# EAGLE design sidpi (EAGLE 6.5.0)
.,m,.m,.m,.m,.m.,m
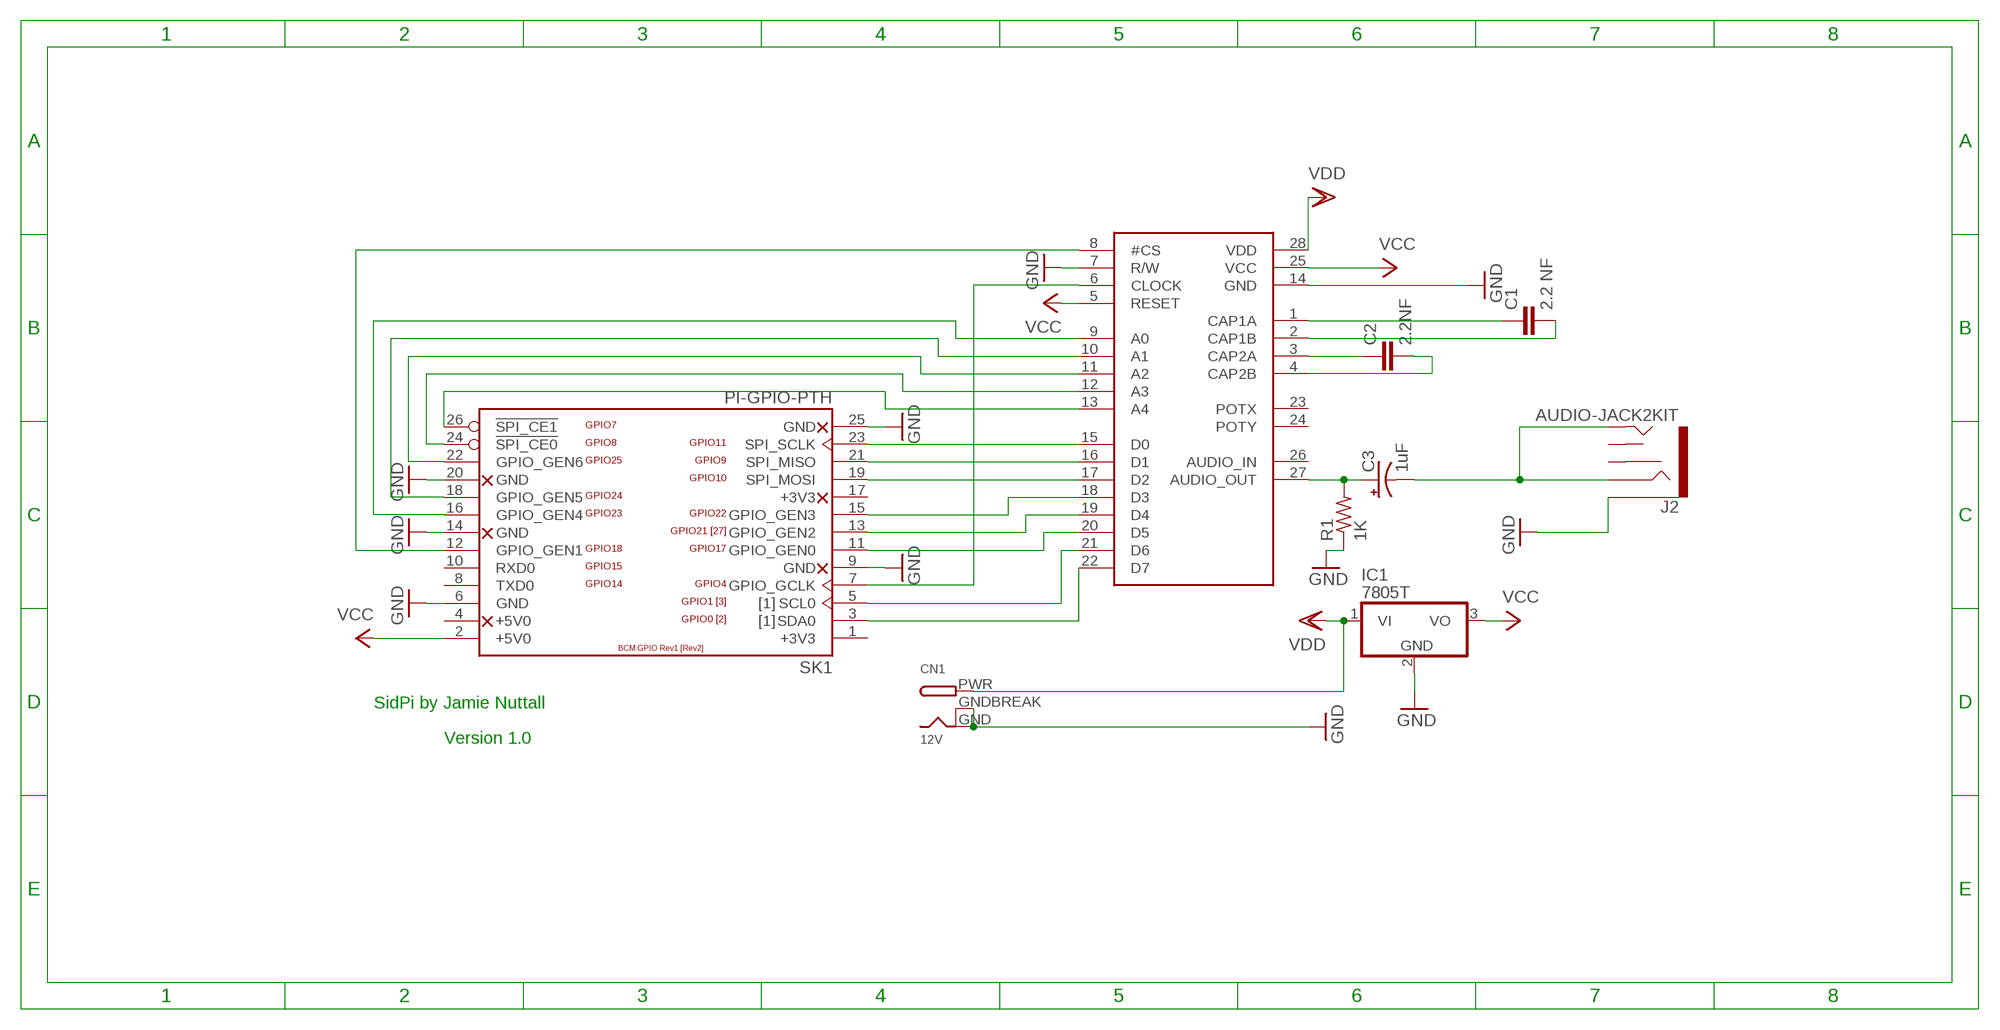
[diagram p0: schematic, sheet 1]

## Parts
C1  2.2 NF  CAPPTH2  [CAP-PTH-SMALL2]
C2  2.2NF  CAPPTH2  [CAP-PTH-SMALL2]
C3  1uF  CPOL-USE1.8-4  [E1,8-4]
CN1  12V  DCBARRELPTH  [DCJACK_2MM_PTH]
IC1  7805T  [TO220H]
J2  AUDIO-JACK2KIT  [AUDIO-JACK-KIT]
R1  1K  R-US_0309/10  [0309/10]
SK1  PI-GPIO-PTH  [GPIO-CONNECTOR]
U$1  6581  [DIL28-6]

## Nets
GND: CN1.GND CN1.GNDBREAK IC1.2(GND) J2.SLEEVE R1.1 SK1.6(GND) SK1.9(GND) SK1.14(GND) SK1.20(GND) SK1.25(GND) U$1.7(R/W) U$1.14(GND)
N$1: SK1.12(GPIO_GEN1) U$1.8(#CS)
N$2: SK1.24(!SPI_CE0) U$1.12(A3)
N$3: C1.1 U$1.1(CAP1A)
N$4: SK1.26(!SPI_CE1) U$1.13(A4)
N$5: SK1.3(SDA0) U$1.22(D7)
N$6: C2.1 U$1.3(CAP2A)
N$7: SK1.5(SCL0) U$1.21(D6)
N$8: C3.- J2.RING J2.TIP
N$9: SK1.7(GPIO_GCLK) U$1.6(CLOCK)
N$10: SK1.11(GPIO_GEN0) U$1.20(D5)
N$11: SK1.13(GPIO_GEN2) U$1.19(D4)
N$12: SK1.15(GPIO_GEN3) U$1.18(D3)
N$13: SK1.19(SPI_MOSI) U$1.17(D2)
N$14: SK1.21(SPI_MISO) U$1.16(D1)
N$15: C2.2 U$1.4(CAP2B)
N$17: C1.2 U$1.2(CAP1B)
N$19: SK1.23(SPI_SCLK) U$1.15(D0)
N$20: SK1.22(GPIO_GEN6) U$1.11(A2)
N$23: C3.+ R1.2 U$1.27(AUDIO_OUT)
N$24: SK1.16(GPIO_GEN4) U$1.9(A0)
N$25: SK1.18(GPIO_GEN5) U$1.10(A1)
VCC [VCC]: IC1.3(VO) SK1.2(+5V0) U$1.5(RESET) U$1.25(VCC)
VDD [VDD]: CN1.PWR IC1.1(VI) U$1.28(VDD)
Unconnected: J2.RSH J2.TSH SK1.4(+5V0) SK1.8(TXD0) SK1.10(RXD0) SK1.17(+3V3) U$1.23(POTX) U$1.24(POTY) U$1.26(AUDIO_IN)

## Notes on the sheet
- SidPi by Jamie Nuttall
- Version 1.0

## Power pins joined to a net without a drawn wire
+3V3: SK1.1(+3V3)

## Library data of the parts
C1 C2 = SparkFun-Capacitors:CAP: Capacitor Standard 0603 ceramic capacitor, and 0.1" leaded capacitor.
C3 = adafruit:CPOL-US: POLARIZED CAPACITOR, American symbol
CN1 = adafruit:DCBARREL: 2.0mm DC Barrel Jack DCJACK_2MM_PTH - Through Hole Jack (4UConnector: 05537)
IC1 = linear:78*: Positive VOLTAGE REGULATOR Source: http://cache.national.com/ds/LM/LM78L05.pdf http://www.fairchildsemi.com/ds/LM/LM7805.pdf; MF: ROHM; MPN: BA17805T; OC_FARNELL: 1831821
J2 = SparkFun-Connectors:AUDIO-JACK2: Stereo audio jack with bypass switches. SMT version used on LilyPad MP3 board.; PROD_ID: CONN-08774
R1 = adafruit:R-US_: RESISTOR, American symbol
SK1 = jt-raspberry-pi:PI-: Raspberry Pi; OC_FARNELL: unknown
U$1 = Mos6581_sid:6581: The Famous C64 Sound Chip - MOS6581; OC_FARNELL: unknown

## Net classes
0 default: width 0.5 mm, drill 0.4 mm, clearance 0.5 mm
1 VDD: width 1 mm, drill 0.4 mm, clearance 0.5 mm
2 VCC: width 1 mm, drill 0.4 mm, clearance 0.5 mm

## Board
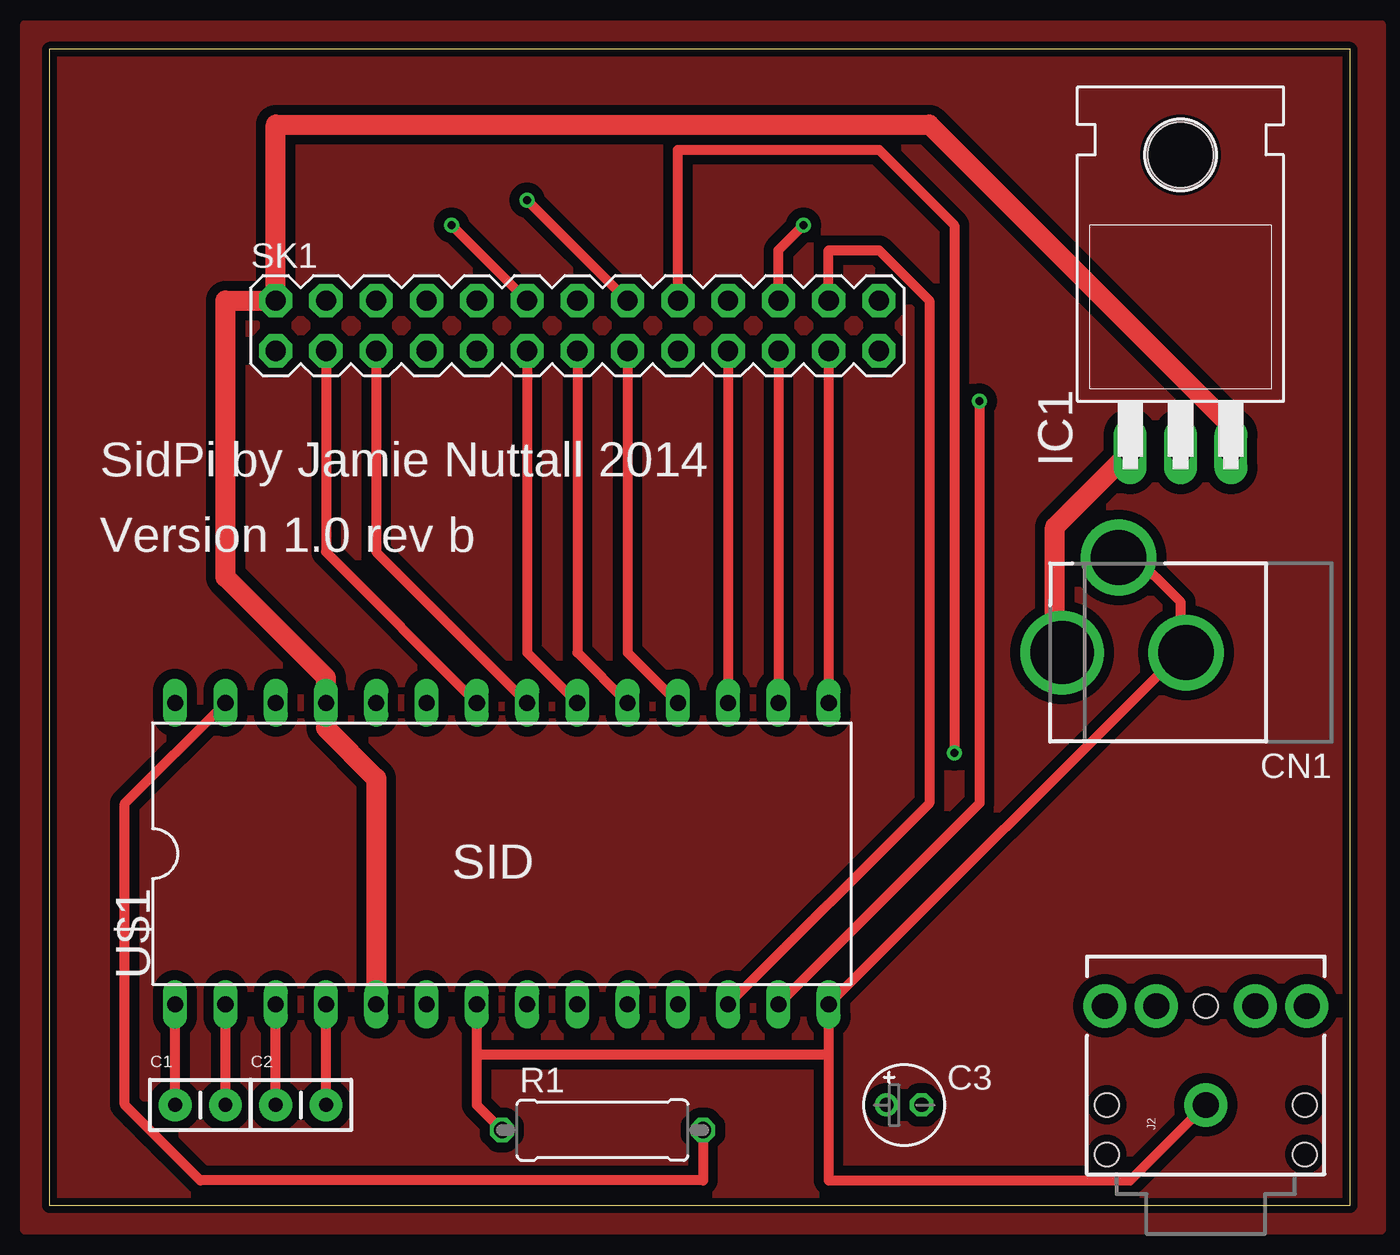
[diagram p1: board, top side]
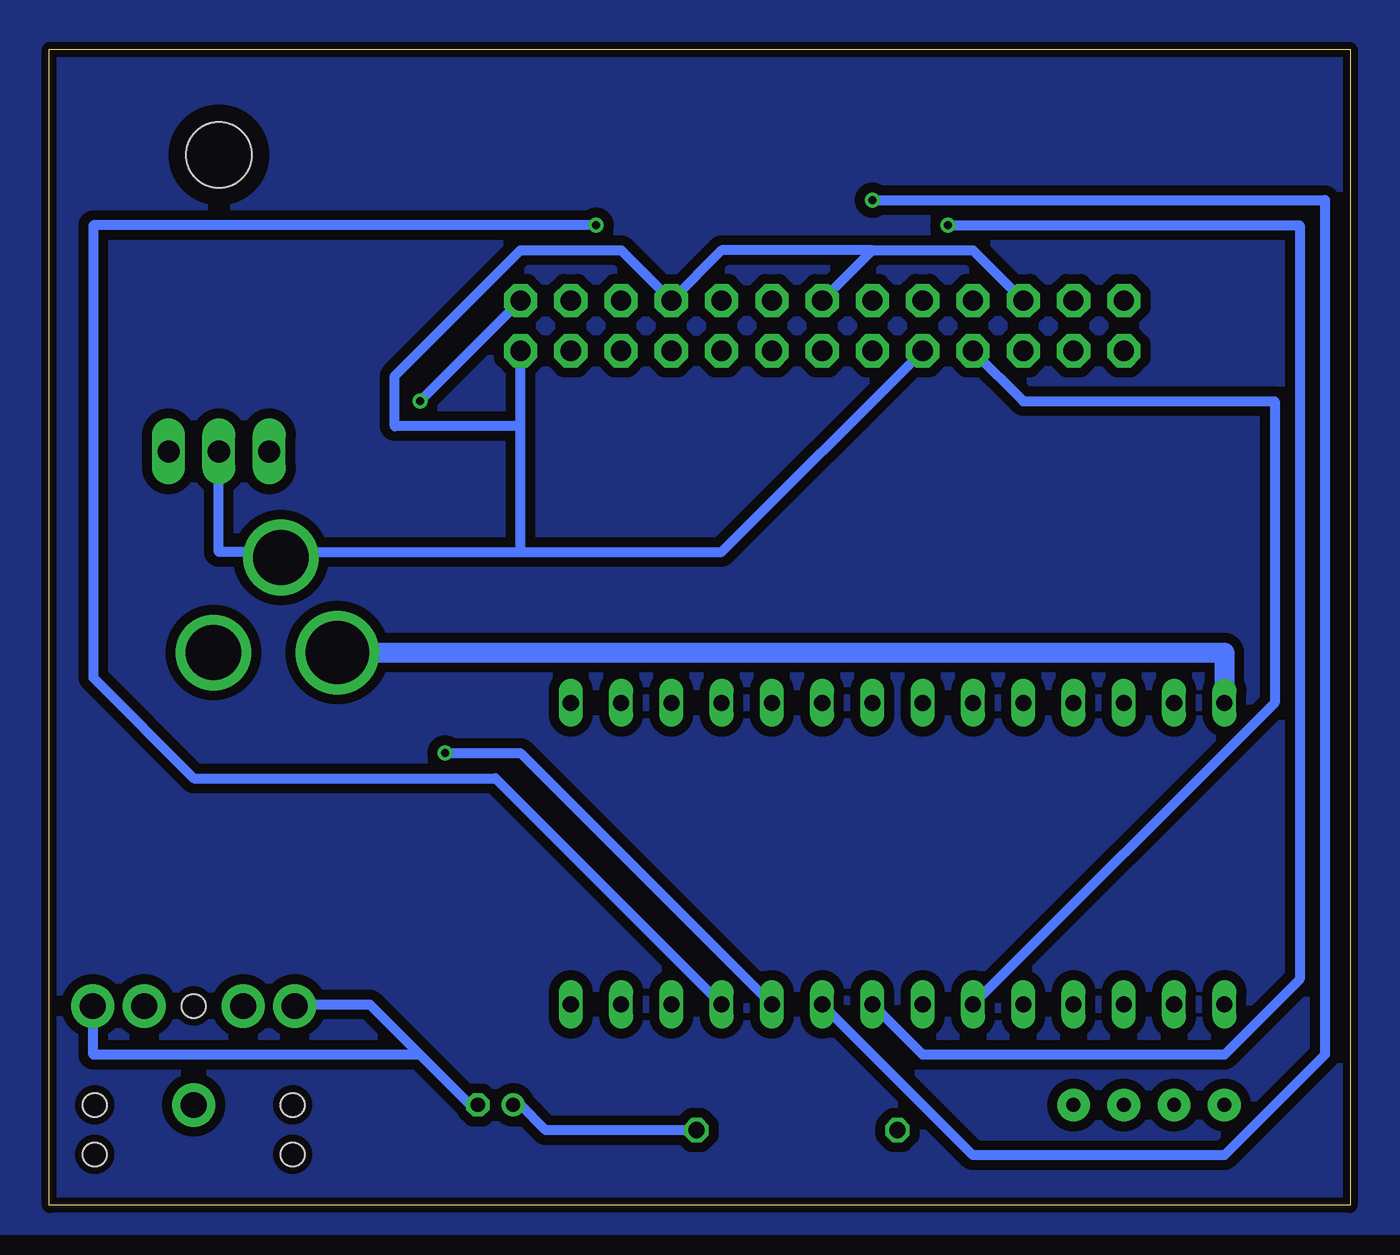
[diagram p2: board, bottom side, seen from below]

Size 65.71 x 58.41 mm. Coordinates in mm from the lower left corner, seen from the top.
Outline: 0,0 65.71,0 65.71,58.41 0,58.41 0,0
Copper layers (1*16): Top 0.0356mm / dielectric 1.5011mm / Bottom 0.0356mm
Design rules "LaenPCBOrder": minimum track width 6mil, minimum drill 13mil, track to track 6mil, track to pad 6mil, pad to pad 6mil, via to via 6mil, smd to smd 6mil, copper to edge 15mil, drill to drill 6mil, minimum pad ring 7mil, minimum via ring 7mil, stop-mask expansion 3mil, vias tented up to drill 0mil, thermal gap 10mil

### Footprints (pad centres in the part's own frame; a part is rotated, then mirrored left to right if it is on the bottom)
CAP-PTH-SMALL2 = drill 0.7 pad 1.651: 1 0,0; 2 2.54,0
E1,8-4 = drill 0.711 pad 1.168: + -0.889,0 | drill 0.711 pad 1.168 octagon: - 0.889,0
DCJACK_2MM_PTH = drill 2.8: GND 0,7.35; GNDBREAK 4.8,10.75 | drill 3.2: PWR 0,13.6
TO220H = drill 1.118 long: 1 -2.54,-10.16; 2 0,-10.16; 3 2.54,-10.16 | hole 3.302: 0,4.826
AUDIO-JACK-KIT = drill 1.3 pad 2.184: RING 5,5.1; RSH 5,2.5; SLEEVE 0,0; TIP 5,-5.1; TSH 5,-2.5 | hole 1.2: 0,5; -2.5,5; -2.5,-5; 0,-5; 5,0
0309/10 = drill 0.813 octagon: 1 -5.08,0; 2 5.08,0
GPIO-CONNECTOR = drill 1.016 pad 1.676 octagon: 1 -15.24,-1.27; 2 -15.24,1.27; 3 -12.7,-1.27; 4 -12.7,1.27; 5 -10.16,-1.27; 6 -10.16,1.27; 7 -7.62,-1.27; 8 -7.62,1.27; 9 -5.08,-1.27; 10 -5.08,1.27; 11 -2.54,-1.27; 12 -2.54,1.27; 13 0,-1.27; 14 0,1.27; 15 2.54,-1.27; 16 2.54,1.27; 17 5.08,-1.27; 18 5.08,1.27; 19 7.62,-1.27; 20 7.62,1.27; 21 10.16,-1.27; 22 10.16,1.27; 23 12.7,-1.27; 24 12.7,1.27; 25 15.24,-1.27; 26 15.24,1.27
DIL28-6 = drill 0.813 long: 1 -16.51,-7.62; 2 -13.97,-7.62; 3 -11.43,-7.62; 4 -8.89,-7.62; 5 -6.35,-7.62; 6 -3.81,-7.62; 7 -1.27,-7.62; 8 1.27,-7.62; 9 3.81,-7.62; 10 6.35,-7.62; 11 8.89,-7.62; 12 11.43,-7.62; 13 13.97,-7.62; 14 16.51,-7.62; 15 16.51,7.62; 16 13.97,7.62; 17 11.43,7.62; 18 8.89,7.62; 19 6.35,7.62; 20 3.81,7.62; 21 1.27,7.62; 22 -1.27,7.62; 23 -3.81,7.62; 24 -6.35,7.62; 25 -8.89,7.62; 26 -11.43,7.62; 27 -13.97,7.62; 28 -16.51,7.62

### Placement (x,y rotation side)
C1  6.35,5.08 0 top
C2  11.43,5.08 0 top
C3  43.18,5.08 0 top
CN1  64.77,27.94 90 top
IC1  57.15,48.26 0 top
J2  58.42,5.08 90 top
R1  27.94,3.81 0 top
SK1  26.67,44.45 0 top
U$1  22.86,17.78 0 top

### Tracks (layer width: path | path; a pad name or v marks a point on that pad's centre or on a via)
GND
  Top 0.5: R1.1 21.59,5.08 21.59,7.62 | U$1.7 21.59,7.62 | 57.15,27.94 U$1.14 39.37,7.62 | J2.SLEEVE 54.61,1.27 39.37,1.27 39.37,7.62 | 39.37,7.62 21.59,7.62 | 57.15,27.94 57.15,30.48 54.61,33.02 CN1.GNDBREAK | 57.15,27.94 CN1.GND
  Bottom 0.5: SK1.6 19.05,48.26 24.13,48.26 | SK1.14 24.13,48.26 | 24.13,48.26 31.75,48.26 SK1.20 36.83,48.26 41.91,48.26 48.26,41.91 48.26,39.37 41.91,39.37 | SK1.9 31.75,33.02 41.91,33.02 | 41.91,33.02 53.34,33.02 CN1.GNDBREAK 54.61,33.02 57.15,33.02 IC1.2 | 41.91,33.02 41.91,39.37 | 41.91,39.37 SK1.25
N$1  (via drill 0.4)
  Top 0.5: SK1.12 v20.32,49.53
  Bottom 0.5: U$1.8 21.59,7.62 6.35,7.62 2.54,11.43 2.54,49.53 v20.32,49.53
N$2
  Top 0.5: U$1.12 44.45,20.32 44.45,45.72 41.91,48.26 39.37,48.26 SK1.24
N$3
  Top 0.5: C1.1 U$1.1
N$4  (via drill 0.4)
  Top 0.5: U$1.13 46.99,20.32 v46.99,40.64
  Bottom 0.5: SK1.26 v46.99,40.64
N$5
  Top 0.5: U$1.22 13.97,33.02 SK1.3
N$6
  Top 0.5: C2.1 U$1.3
N$7
  Top 0.5: U$1.21 16.51,33.02 SK1.5
N$8
  Bottom 0.5: 46.99,7.62 49.53,10.16 53.34,10.16 J2.RING | 46.99,7.62 44.45,5.08 C3.- | 46.99,7.62 63.5,7.62 63.5,10.16 J2.TIP
N$9
  Bottom 0.5: U$1.6 3.81,25.4 3.81,40.64 16.51,40.64 SK1.7
N$10
  Top 0.5: U$1.20 24.13,27.94 SK1.11
N$11
  Top 0.5: U$1.19 26.67,27.94 SK1.13
N$12
  Top 0.5: U$1.18 29.21,27.94 SK1.15
N$13
  Top 0.5: SK1.19 U$1.17
N$14
  Top 0.5: SK1.21 U$1.16
N$15
  Top 0.5: C2.2 U$1.4
N$16
  pour Top: -1.27,59.69 67.31,59.69 67.31,-1.27 -1.27,-1.27
N$17
  Top 0.5: C1.2 U$1.2
N$18
  pour Bottom: -2.54,60.96 68.58,60.96 68.58,-1.27 -2.54,-1.27
N$19
  Top 0.5: SK1.23 U$1.15
N$20  (via drill 0.4)
  Top 0.5: v38.1,49.53 36.83,48.26 SK1.22
  Bottom 0.5: U$1.11 43.18,21.59 58.42,21.59 63.5,26.67 63.5,49.53 v38.1,49.53
N$23
  Top 0.5: U$1.27 3.81,20.32 3.81,5.08 7.62,1.27 33.02,1.27 R1.2
  Bottom 0.5: R1.2 40.64,3.81 41.91,5.08 C3.+
N$24  (via drill 0.4)
  Top 0.5: SK1.16 v24.13,50.8
  Bottom 0.5: U$1.9 19.05,2.54 6.35,2.54 1.27,7.62 1.27,50.8 v24.13,50.8
N$25  (via drill 0.4)
  Top 0.5: v45.72,22.86 45.72,49.53 41.91,53.34 31.75,53.34 SK1.18
  Bottom 0.5: U$1.10 41.91,22.86 v45.72,22.86
VCC
  Top 1: U$1.5 16.51,21.59 13.97,24.13 U$1.25 13.97,26.67 8.89,31.75 8.89,45.72 SK1.2 11.43,54.61 44.45,54.61 59.69,39.37 IC1.3
VDD
  Top 1: IC1.1 50.8,34.29 50.8,27.94 CN1.PWR
  Bottom 1: U$1.28 6.35,27.94 CN1.PWR

### Text on the board
tNames: SidPi by Jamie Nuttall 2014 | Version 1.0 rev b | SID